# Altium schematic sheet Power.SchDoc
size A4
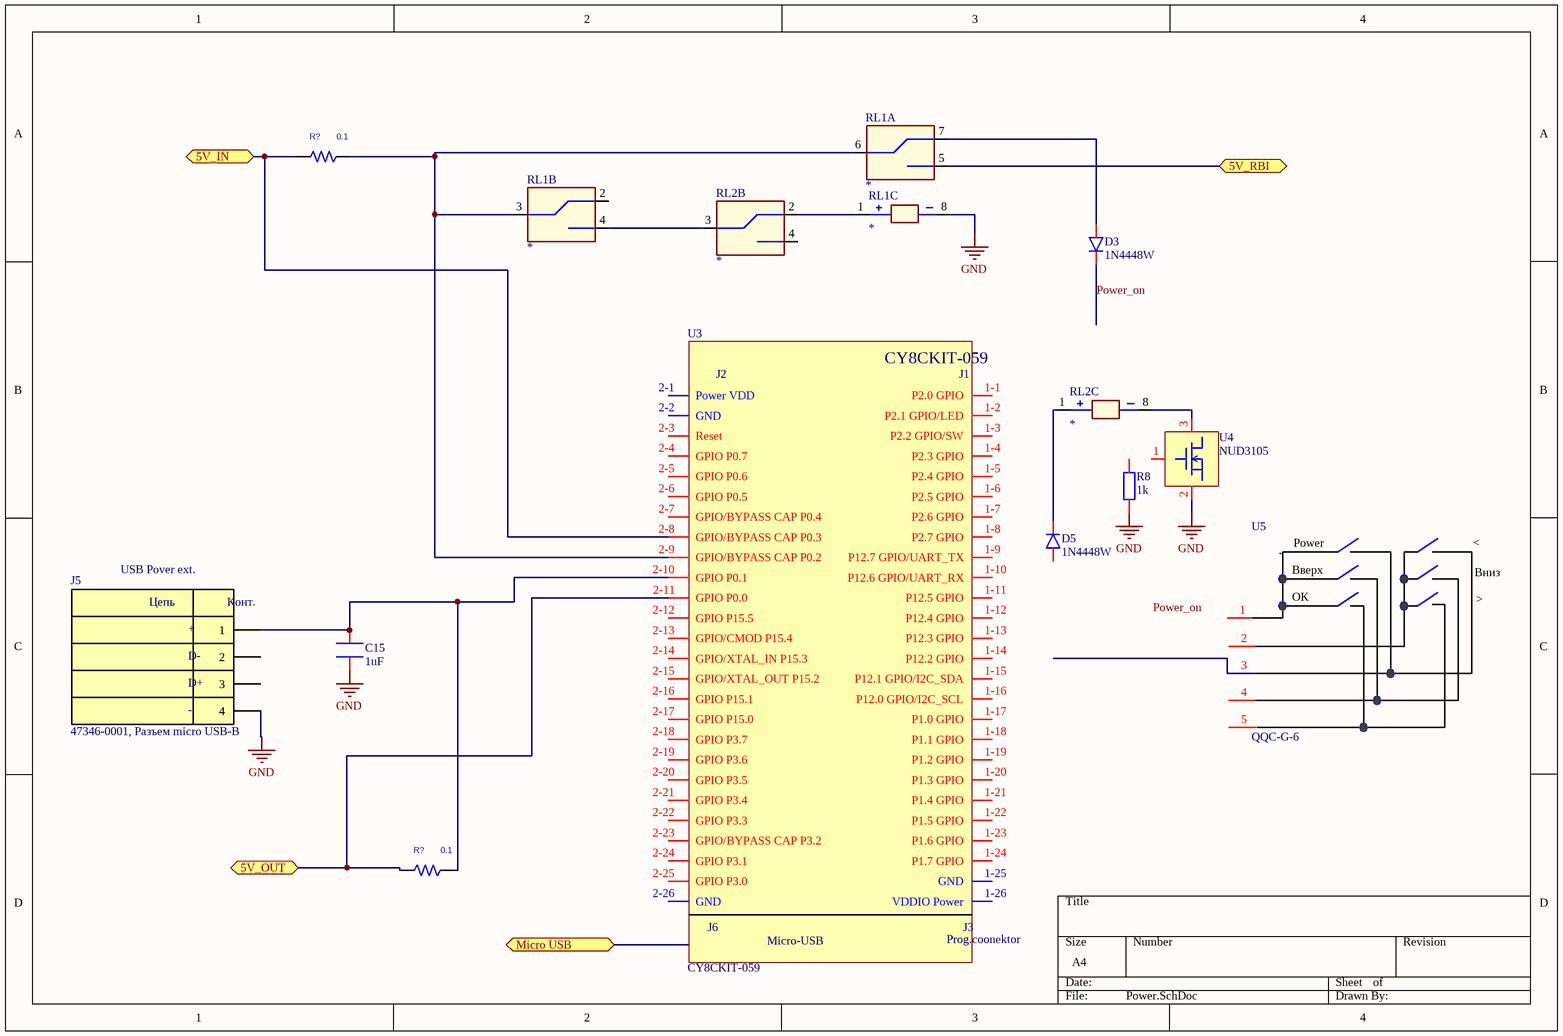
[diagram p0: Power.SchDoc]

## Parts
(Parts that share a designator on the sheet are numbered #1, #2 ... from top to bottom, then left to right.)
C15  1uF  [SMD0603]
D3  1N4448W  [SMA DIOD]
D5  1N4448W  [SMA DIOD]
J5  47346-0001, Разъем micro USB-B  [MF-4MA]
R8  1k  [SMD0805]
R?#1  0.1  [SMD1206]
R?#2  0.1  [SMD1206]
RL1  *  [IM06GR]  (parts A,B,C of 3)
RL2  *  [IM06GR]  (parts B,C of 3)
U3  CY8CKIT-059  [CY8CKIT-059]
U4  NUD3105  [SOT-23]
U5  QQC-G-6  [PSOP8]

## Ports
5V_IN, 5V_OUT, 5V_RBI, Micro USB (bidir)

## Nets
GND: C15.1 J5.4 R8.1 RL1.8(-) U4.2(S)
5V_IN: R?#1.1 U3.2-8(GPIO/BYPASS_CAP_P0.3) ; port 5V_IN
5V_OUT: R?#2.1 U3.2-11(GPIO_P0.0) ; port 5V_OUT
5V_RBI: RL1.5(A11) ; port 5V_RBI
Power_on: D3.K
NetC15_2: C15.2 J5.1 R?#2.2 U3.2-10(GPIO_P0.1)
NetD3_A: D3.A RL1.7(A10)
NetD5_K: D5.K RL2.1(+)
NetR?#1_2: R?#1.2 RL1.3(A12) RL1.6(A9) U3.2-9(GPIO/BYPASS_CAP_P0.2)
NetRL1_1: RL1.1(+) RL2.2(A13)
NetRL1_4: RL1.4(A14) RL2.3(A12)
NetRL2_8: RL2.8(-) U4.3(D)

Not connected (* = marked no-connect by the designer): D5 A; J5 2 3; R8 2; RL1 2(A13); RL2 4(A14); U3 1-1(P2.0_GPIO) 1-2(P2.1_GPIO/LED) 1-3(P2.2_GPIO/SW) 1-4(P2.3_GPIO) 1-5(P2.4_GPIO) 1-6(P2.5_GPIO) 1-7(P2.6_GPIO) 1-8(P2.7_GPIO) 1-9(P12.7_GPIO/UART_TX) 1-10(P12.6_GPIO/UART_RX) 1-11(P12.5_GPIO) 1-12(P12.4_GPIO) 1-13(P12.3_GPIO) 1-14(P12.2_GPIO) 1-15(P12.1_GPIO/I2C_SDA) 1-16(P12.0_GPIO/I2C_SCL) 1-17(P1.0_GPIO) 1-18(P1.1_GPIO) 1-19(P1.2_GPIO) 1-20(P1.3_GPIO) 1-21(P1.4_GPIO) 1-22(P1.5_GPIO) 1-23(P1.6_GPIO) 1-24(P1.7_GPIO) 1-25(GND) 1-26(VDDIO_Power) 2-1(Power_VDD) 2-2(GND) 2-3(Reset) 2-4(GPIO_P0.7) 2-5(GPIO_P0.6) 2-6(GPIO_P0.5) 2-7(GPIO/BYPASS_CAP_P0.4) 2-12(GPIO_P15.5) 2-13(GPIO/CMOD_P15.4) 2-14(GPIO/XTAL_IN_P15.3) 2-15(GPIO/XTAL_OUT_P15.2) 2-16(GPIO_P15.1) 2-17(GPIO_P15.0) 2-18(GPIO_P3.7) 2-19(GPIO_P3.6) 2-20(GPIO_P3.5) 2-21(GPIO_P3.4) 2-22(GPIO_P3.3) 2-23(GPIO/BYPASS_CAP_P3.2) 2-24(GPIO_P3.1) 2-25(GPIO_P3.0) 2-26(GND); U4 1(G); U5 1 2 3 4 5

## Notes on the sheet
- USB Pover ext.
- Labels drawn without touching a wire or pin: Power_on
- (in symbol CY8CKIT-059) J2; J1; J6; J3; Micro-USB; Prog.coonektor
- (in symbol pin4) Цепь; Конт.
- (in symbol QQC-G-6) Power; <; Вверх; Вниз; ОК; >

## Library data of the parts
C15 = CAP: value: *
D3 D5 = DIOD: value: *
J5 = pin4: Name1: +; Name2: D-; Name3: D+; Name4: -
R8 = RES_SMD: value: 1k
R?#1 R?#2 = R: TC2: 0; POWER: RMAX; MAX_TEMP: RTMAX; SLOPE: RSMAX; VOLTAGE: RVMAX; PSpiceTemplate: R^@REFDES %1 %2 ?TOLERANCE|R^@REFDES| @VALUE TC=@TC1,@TC2 ?TOLERANCE|\n.model R^@REFDES RES R=1 DEV=@TOLERANCE% TC1=@TC1 TC2=@TC2|; DIST: FLAT; Value: 16k; TC1: 0
RL1 RL2 = Relay_2 switch: value: *